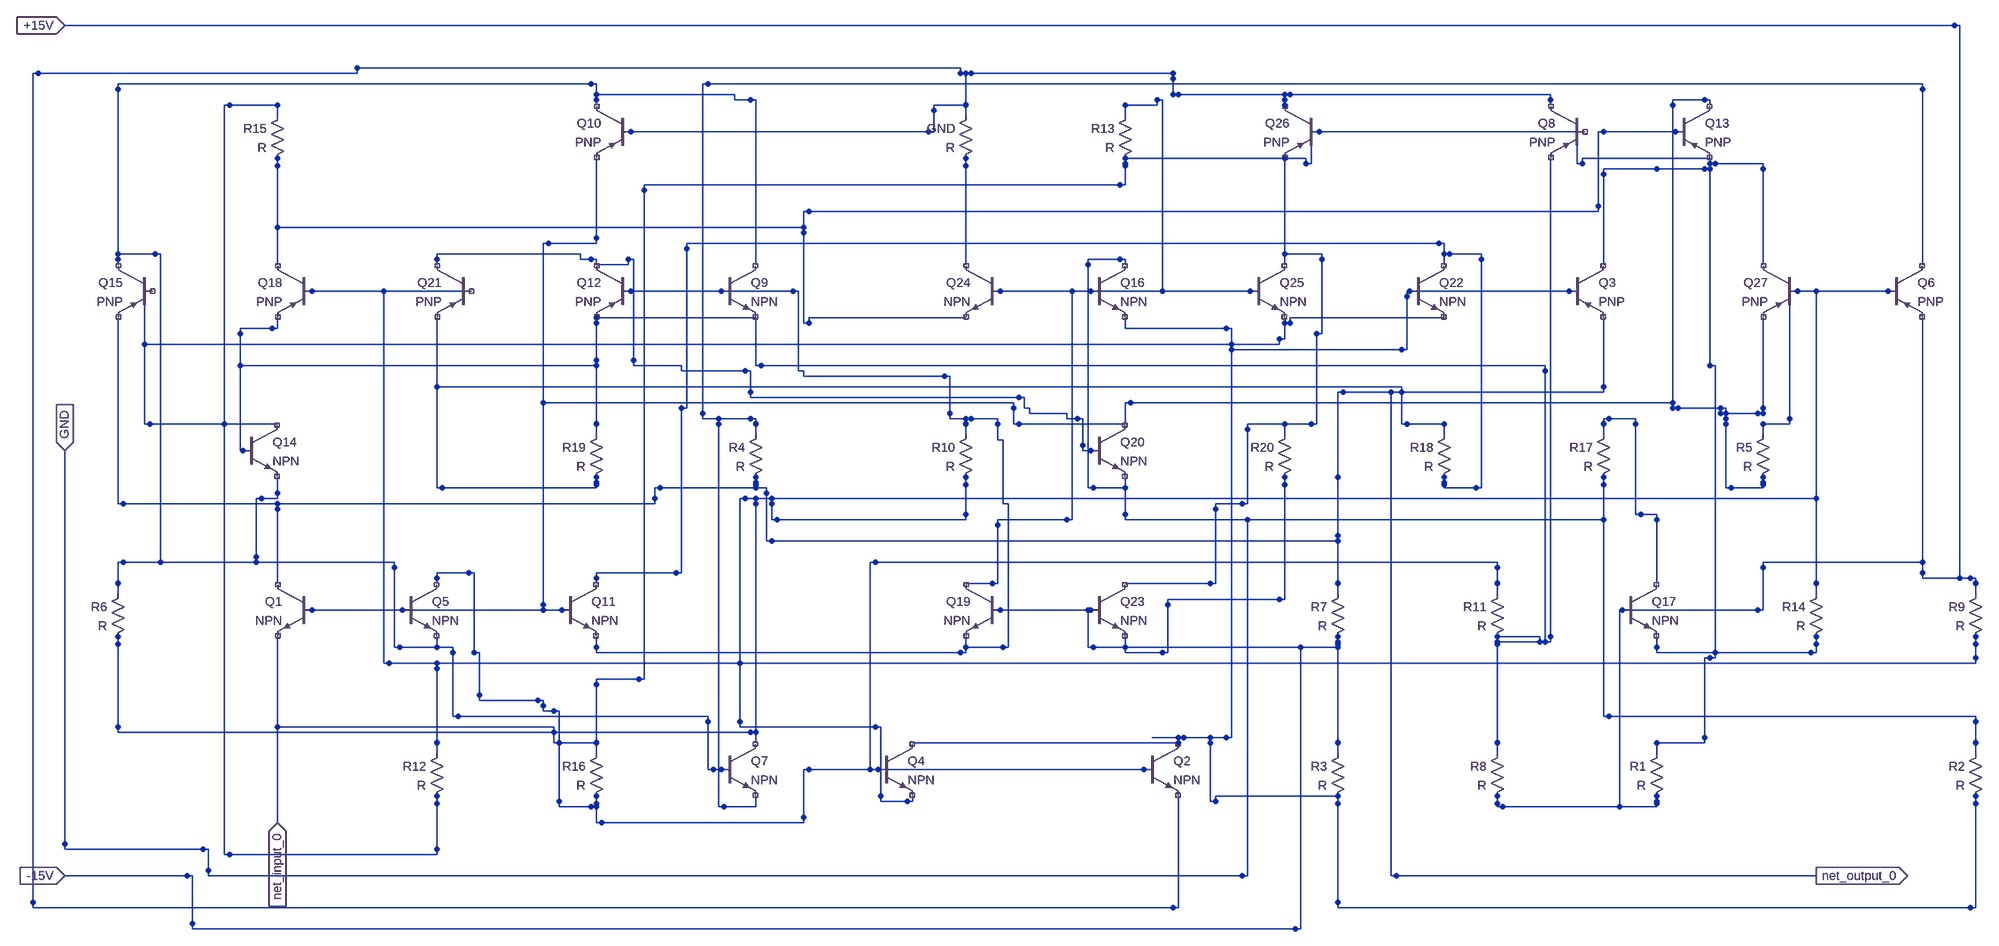
[diagram p0: schematic output-schematic.asc]
output-schematic.asc, the LTspice schematic file:
Version 4
SHEET 1 2000 4000
SYMBOL npn 715 1202 M0
SYMATTR InstName Q1
SYMBOL npn 2285 1502 R0
SYMATTR InstName Q2
SYMBOL pnp 3085 602 R0
SYMATTR InstName Q3
SYMBOL npn 1785 1502 R0
SYMATTR InstName Q4
SYMBOL npn 885 1202 R0
SYMATTR InstName Q5
SYMBOL pnp 3685 602 R0
SYMATTR InstName Q6
SYMBOL npn 1485 1502 R0
SYMATTR InstName Q7
SYMBOL pnp 3115 302 M0
SYMATTR InstName Q8
SYMBOL npn 1485 602 R0
SYMATTR InstName Q9
SYMBOL pnp 1315 302 M0
SYMATTR InstName Q10
SYMBOL npn 1185 1202 R0
SYMATTR InstName Q11
SYMBOL pnp 1315 602 M0
SYMATTR InstName Q12
SYMBOL pnp 3285 302 R0
SYMATTR InstName Q13
SYMBOL npn 585 902 R0
SYMATTR InstName Q14
SYMBOL pnp 415 602 M0
SYMATTR InstName Q15
SYMBOL npn 2185 602 R0
SYMATTR InstName Q16
SYMBOL npn 3185 1202 R0
SYMATTR InstName Q17
SYMBOL pnp 715 602 M0
SYMATTR InstName Q18
SYMBOL npn 2015 1202 M0
SYMATTR InstName Q19
SYMBOL npn 2185 902 R0
SYMATTR InstName Q20
SYMBOL pnp 1015 602 M0
SYMATTR InstName Q21
SYMBOL npn 2785 602 R0
SYMATTR InstName Q22
SYMBOL npn 2185 1202 R0
SYMATTR InstName Q23
SYMBOL npn 2015 602 M0
SYMATTR InstName Q24
SYMBOL npn 2485 602 R0
SYMATTR InstName Q25
SYMBOL pnp 2615 302 M0
SYMATTR InstName Q26
SYMBOL pnp 3515 602 M0
SYMATTR InstName Q27
SYMBOL res 3266 1504 M0
SYMATTR InstName R1
WIRE 3250 1520 3250 1499
WIRE 3250 1614 3250 1599
SYMBOL res 3866 1504 M0
SYMATTR InstName R2
WIRE 3850 1520 3850 1499
WIRE 3850 1614 3850 1599
SYMBOL res 2666 1504 M0
SYMATTR InstName R3
WIRE 2650 1520 2650 1499
WIRE 2650 1614 2650 1599
SYMBOL res 1566 904 M0
SYMATTR InstName R4
WIRE 1550 920 1550 899
WIRE 1550 1014 1550 999
SYMBOL res 3466 904 M0
SYMATTR InstName R5
WIRE 3450 920 3450 899
WIRE 3450 1014 3450 999
SYMBOL res 366 1204 M0
SYMATTR InstName R6
WIRE 350 1220 350 1199
WIRE 350 1314 350 1299
SYMBOL res 2666 1204 M0
SYMATTR InstName R7
WIRE 2650 1220 2650 1199
WIRE 2650 1314 2650 1299
SYMBOL res 2966 1504 M0
SYMATTR InstName R8
WIRE 2950 1520 2950 1499
WIRE 2950 1614 2950 1599
SYMBOL res 3866 1204 M0
SYMATTR InstName R9
WIRE 3850 1220 3850 1199
WIRE 3850 1314 3850 1299
SYMBOL res 1966 904 M0
SYMATTR InstName R10
WIRE 1950 920 1950 899
WIRE 1950 1014 1950 999
SYMBOL res 2966 1204 M0
SYMATTR InstName R11
WIRE 2950 1220 2950 1199
WIRE 2950 1314 2950 1299
SYMBOL res 966 1504 M0
SYMATTR InstName R12
WIRE 950 1520 950 1499
WIRE 950 1614 950 1599
SYMBOL res 2266 304 M0
SYMATTR InstName R13
WIRE 2250 320 2250 299
WIRE 2250 414 2250 399
SYMBOL res 3566 1204 M0
SYMATTR InstName R14
WIRE 3550 1220 3550 1199
WIRE 3550 1314 3550 1299
SYMBOL res 666 304 M0
SYMATTR InstName R15
WIRE 650 320 650 299
WIRE 650 414 650 399
SYMBOL res 1266 1504 M0
SYMATTR InstName R16
WIRE 1250 1520 1250 1499
WIRE 1250 1614 1250 1599
SYMBOL res 3166 904 M0
SYMATTR InstName R17
WIRE 3150 920 3150 899
WIRE 3150 1014 3150 999
SYMBOL res 2866 904 M0
SYMATTR InstName R18
WIRE 2850 920 2850 899
WIRE 2850 1014 2850 999
SYMBOL res 1266 904 M0
SYMATTR InstName R19
WIRE 1250 920 1250 899
WIRE 1250 1014 1250 999
SYMBOL res 2566 904 M0
SYMATTR InstName R20
WIRE 2550 920 2550 899
WIRE 2550 1014 2550 999
SYMBOL res 1966 304 M0
SYMATTR InstName R21
WIRE 1950 320 1950 299
WIRE 1950 414 1950 399
SYMATTR InstName net_output_0
FLAG 3550 1750 net_output_0
IOPIN 3550 1750 Out
SYMATTR InstName net_input_0
FLAG 650 1650 net_input_0
IOPIN 650 1650 In
SYMATTR InstName +15V
FLAG 250 150 +15V
IOPIN 250 150 In
SYMATTR InstName -15V
FLAG 250 1750 -15V
IOPIN 250 1750 In
SYMATTR InstName GND
FLAG 250 950 GND
IOPIN 250 950 In
WIRE 3700 650 3500 650
WIRE 3500 650 3500 890
WIRE 3500 890 3500 890
WIRE 3500 890 3500 900
WIRE 3500 900 3450 900
WIRE 3550 1200 3550 650
WIRE 350 1300 350 1470
WIRE 350 1470 350 1470
WIRE 350 1470 350 1480
WIRE 350 1480 1540 1480
WIRE 1540 1480 1540 1480
WIRE 1540 1480 1550 1480
WIRE 1550 1480 1550 1500
WIRE 1550 1500 1550 1050
WIRE 1550 1050 1550 1050
WIRE 1550 1050 1550 1040
WIRE 1550 1040 3550 1040
WIRE 700 650 1000 650
WIRE 1950 1000 1950 1070
WIRE 1950 1070 1950 1070
WIRE 1950 1070 1950 1080
WIRE 1950 1080 1590 1080
WIRE 1590 1080 1590 1080
WIRE 1590 1080 1580 1080
WIRE 1580 1080 1580 1050
WIRE 1580 1050 1580 1050
WIRE 1580 1050 1580 1040
WIRE 1580 1040 1530 1040
WIRE 1530 1040 1530 1040
WIRE 1530 1040 1520 1040
WIRE 1520 1040 1520 1460
WIRE 1520 1460 1520 1460
WIRE 1520 1460 1520 1470
WIRE 1520 1470 1780 1470
WIRE 1780 1470 1780 1470
WIRE 1780 1470 1790 1470
WIRE 1790 1470 1790 1600
WIRE 1790 1600 1790 1600
WIRE 1790 1600 1790 1610
WIRE 1790 1610 1840 1610
WIRE 1840 1610 1840 1610
WIRE 1840 1610 1850 1610
WIRE 1850 1610 1850 1600
WIRE 950 1500 950 1360
WIRE 950 1360 950 1360
WIRE 950 1360 950 1350
WIRE 950 1350 860 1350
WIRE 860 1350 860 1350
WIRE 860 1350 850 1350
WIRE 850 1350 850 650
WIRE 1520 1350 950 1350
WIRE 3850 1300 3850 1340
WIRE 3850 1340 3850 1340
WIRE 3850 1340 3850 1350
WIRE 3850 1350 1520 1350
WIRE 3450 600 3450 420
WIRE 3450 420 3450 420
WIRE 3450 420 3450 410
WIRE 3450 410 3360 410
WIRE 3360 410 3360 410
WIRE 3360 410 3350 410
WIRE 3350 410 3350 400
WIRE 3350 400 3110 400
WIRE 3110 400 3110 410
WIRE 3110 410 3110 410
WIRE 3110 410 3100 410
WIRE 3100 410 3100 350
WIRE 3150 600 3150 430
WIRE 3150 430 3150 430
WIRE 3150 430 3150 420
WIRE 3150 420 3340 420
WIRE 3340 420 3340 420
WIRE 3340 420 3350 420
WIRE 3350 420 3350 410
WIRE 650 1300 650 1650
WIRE 2250 400 2590 400
WIRE 2590 400 2590 410
WIRE 2590 410 2590 410
WIRE 2590 410 2600 410
WIRE 2600 410 2600 350
WIRE 3100 350 2600 350
WIRE 1250 1500 1180 1500
WIRE 1180 1500 1180 1500
WIRE 1180 1500 1170 1500
WIRE 1170 1500 1170 1480
WIRE 1170 1480 1170 1480
WIRE 1170 1480 1170 1470
WIRE 1170 1470 650 1470
WIRE 3250 420 3340 420
WIRE 3340 420 3340 420
WIRE 3340 420 3350 420
WIRE 3350 420 3350 790
WIRE 3350 790 3350 790
WIRE 3350 790 3360 790
WIRE 3360 790 3360 1330
WIRE 3360 1330 3360 1330
WIRE 3360 1330 3360 1340
WIRE 3360 1340 3350 1340
WIRE 3350 1340 3350 1340
WIRE 3350 1340 3340 1340
WIRE 3340 1340 3340 1490
WIRE 3340 1490 3340 1490
WIRE 3340 1490 3340 1500
WIRE 3340 1500 3250 1500
WIRE 1250 1500 1250 1390
WIRE 1250 1390 1250 1390
WIRE 1250 1390 1250 1380
WIRE 1250 1380 1330 1380
WIRE 1330 1380 1330 1380
WIRE 1330 1380 1340 1380
WIRE 1340 1380 1340 460
WIRE 1340 460 1340 460
WIRE 1340 460 1340 450
WIRE 1340 450 2240 450
WIRE 2240 450 2240 450
WIRE 2240 450 2250 450
WIRE 2250 450 2250 410
WIRE 700 1250 900 1250
WIRE 3450 1000 3450 1010
WIRE 3450 1010 3450 1020
WIRE 3450 1020 3390 1020
WIRE 3390 1020 3390 1020
WIRE 3390 1020 3380 1020
WIRE 3380 1020 3380 890
WIRE 3380 890 3380 890
WIRE 3380 890 3380 880
WIRE 3380 880 3440 880
WIRE 3440 880 3440 880
WIRE 3440 880 3450 880
WIRE 3450 880 3450 700
WIRE 1200 1250 900 1250
WIRE 3450 700 3450 870
WIRE 3450 870 3450 870
WIRE 3450 870 3450 880
WIRE 3450 880 3380 880
WIRE 3380 880 3380 880
WIRE 3380 880 3380 870
WIRE 3380 870 3290 870
WIRE 3290 870 3290 870
WIRE 3290 870 3280 870
WIRE 3280 870 3280 300
WIRE 3280 300 3280 300
WIRE 3280 300 3280 290
WIRE 3280 290 3340 290
WIRE 3340 290 3340 290
WIRE 3340 290 3350 290
WIRE 3350 290 3350 300
WIRE 1250 400 1250 550
WIRE 1250 550 1250 550
WIRE 1250 550 1250 560
WIRE 1250 560 1160 560
WIRE 1160 560 1160 560
WIRE 1160 560 1150 560
WIRE 1150 560 1150 1240
WIRE 1150 1240 1150 1240
WIRE 1150 1240 1150 1250
WIRE 1150 1250 1200 1250
WIRE 2250 900 2050 900
WIRE 2050 900 2050 900
WIRE 2050 900 2040 900
WIRE 2040 900 2040 870
WIRE 2040 870 2040 870
WIRE 2040 870 2040 860
WIRE 2040 860 1150 860
WIRE 3380 900 3380 880
WIRE 3380 880 3370 880
WIRE 3370 880 3370 880
WIRE 3370 880 3370 870
WIRE 3370 870 3280 870
WIRE 3280 870 3280 870
WIRE 3280 870 3280 860
WIRE 3280 860 2260 860
WIRE 2260 860 2260 860
WIRE 2260 860 2250 860
WIRE 2250 860 2250 900
WIRE 650 900 410 900
WIRE 410 900 410 900
WIRE 410 900 400 900
WIRE 400 900 400 650
WIRE 2850 700 2560 700
WIRE 2560 700 2560 710
WIRE 2560 710 2560 710
WIRE 2560 710 2550 710
WIRE 2550 710 2550 700
WIRE 650 300 560 300
WIRE 560 300 560 300
WIRE 560 300 550 300
WIRE 550 300 550 900
WIRE 950 1600 950 1700
WIRE 950 1700 950 1700
WIRE 950 1700 950 1710
WIRE 950 1710 560 1710
WIRE 560 1710 560 1710
WIRE 560 1710 550 1710
WIRE 550 1710 550 900
WIRE 2550 710 2550 740
WIRE 2550 740 2540 740
WIRE 2540 740 2540 740
WIRE 2540 740 2540 750
WIRE 2540 750 400 750
WIRE 2950 1500 2950 1300
WIRE 1250 900 1250 700
WIRE 600 950 590 950
WIRE 590 950 580 950
WIRE 580 950 580 730
WIRE 580 730 580 730
WIRE 580 730 580 720
WIRE 580 720 640 720
WIRE 640 720 640 720
WIRE 640 720 650 720
WIRE 650 720 650 700
WIRE 1550 700 1250 700
WIRE 1250 700 1250 710
WIRE 1250 700 1250 780
WIRE 1250 780 1250 780
WIRE 1250 780 1250 790
WIRE 1250 790 580 790
WIRE 3050 400 3050 1300
WIRE 3050 1300 3050 1300
WIRE 3050 1300 3050 1310
WIRE 3050 1310 2950 1310
WIRE 2950 1300 3030 1300
WIRE 3030 1300 3030 1310
WIRE 3030 1310 3030 1310
WIRE 3030 1310 3040 1310
WIRE 3040 1310 3040 800
WIRE 3040 800 3040 800
WIRE 3040 800 3040 790
WIRE 3040 790 1560 790
WIRE 1560 790 1560 790
WIRE 1560 790 1550 790
WIRE 1550 790 1550 700
WIRE 650 1200 650 1060
WIRE 650 1060 650 1060
WIRE 650 1060 650 1050
WIRE 650 1050 360 1050
WIRE 360 1050 360 1050
WIRE 360 1050 350 1050
WIRE 350 1050 350 700
WIRE 3150 700 3150 830
WIRE 3150 830 3150 830
WIRE 3150 830 3150 840
WIRE 3150 840 2660 840
WIRE 2660 840 2660 840
WIRE 2660 840 2650 840
WIRE 2650 840 2650 1200
WIRE 1550 1000 1550 1010
WIRE 1550 1010 1550 1020
WIRE 1550 1020 1370 1020
WIRE 1370 1020 1370 1020
WIRE 1370 1020 1360 1020
WIRE 1360 1020 1360 1040
WIRE 1360 1040 1360 1040
WIRE 1360 1040 1360 1050
WIRE 1360 1050 650 1050
WIRE 3550 1750 2760 1750
WIRE 2760 1750 2760 1750
WIRE 2760 1750 2750 1750
WIRE 2750 1750 2750 840
WIRE 2650 1000 2650 1110
WIRE 2650 1110 2650 1110
WIRE 2650 1110 2650 1120
WIRE 2650 1120 1580 1120
WIRE 1580 1120 1580 1120
WIRE 1580 1120 1570 1120
WIRE 1570 1120 1570 1030
WIRE 1570 1030 1570 1030
WIRE 1570 1030 1570 1020
WIRE 1570 1020 1550 1020
WIRE 1550 1600 1550 1610
WIRE 1550 1610 1550 1620
WIRE 1550 1620 1490 1620
WIRE 1490 1620 1490 1620
WIRE 1490 1620 1480 1620
WIRE 1480 1620 1480 900
WIRE 1480 900 1480 900
WIRE 1480 900 1480 890
WIRE 1480 890 1540 890
WIRE 1540 890 1540 890
WIRE 1540 890 1550 890
WIRE 1550 890 1550 900
WIRE 3750 600 3750 270
WIRE 3750 270 3750 270
WIRE 3750 270 3750 260
WIRE 3750 260 1460 260
WIRE 1460 260 1460 260
WIRE 1460 260 1450 260
WIRE 1450 260 1450 880
WIRE 1450 880 1450 880
WIRE 1450 880 1450 890
WIRE 1450 890 1480 890
WIRE 650 600 650 400
WIRE 1950 700 1650 700
WIRE 1650 700 1650 710
WIRE 1650 710 1650 710
WIRE 1650 710 1640 710
WIRE 1640 710 1640 540
WIRE 1640 540 1640 540
WIRE 1640 540 1640 530
WIRE 1640 530 650 530
WIRE 3300 350 3150 350
WIRE 3150 350 3150 350
WIRE 3150 350 3140 350
WIRE 3140 350 3140 490
WIRE 3140 490 3140 490
WIRE 3140 490 3140 500
WIRE 3140 500 1650 500
WIRE 1650 500 1650 500
WIRE 1650 500 1640 500
WIRE 1640 500 1640 530
WIRE 3050 300 3050 290
WIRE 3050 290 3050 290
WIRE 3050 290 3050 280
WIRE 3050 280 2560 280
WIRE 2560 280 2560 280
WIRE 2560 280 2550 280
WIRE 2550 280 2550 300
WIRE 2550 300 2550 290
WIRE 2550 290 2550 290
WIRE 2550 290 2550 280
WIRE 2550 280 2350 280
WIRE 2350 280 2350 280
WIRE 2350 280 2340 280
WIRE 2340 280 2340 250
WIRE 2340 250 2340 250
WIRE 2340 250 2340 240
WIRE 2340 240 1960 240
WIRE 1960 240 1960 240
WIRE 1960 240 1950 240
WIRE 1950 240 1950 300
WIRE 1300 350 1880 350
WIRE 1880 350 1880 350
WIRE 1880 350 1890 350
WIRE 1890 350 1890 310
WIRE 1890 310 1890 310
WIRE 1890 310 1890 300
WIRE 1890 300 1950 300
WIRE 2550 300 2550 290
WIRE 2550 290 2550 290
WIRE 2550 290 2550 280
WIRE 2550 280 2350 280
WIRE 2350 280 2350 280
WIRE 2350 280 2340 280
WIRE 2340 280 2340 250
WIRE 2340 250 2340 250
WIRE 2340 250 2340 240
WIRE 2340 240 1940 240
WIRE 1940 240 1940 240
WIRE 1940 240 1940 230
WIRE 1940 230 800 230
WIRE 800 230 800 230
WIRE 800 230 800 240
WIRE 800 240 200 240
WIRE 200 240 200 240
WIRE 200 240 190 240
WIRE 190 240 190 1800
WIRE 190 1800 190 1800
WIRE 190 1800 190 1810
WIRE 190 1810 2340 1810
WIRE 2340 1810 2340 1810
WIRE 2340 1810 2350 1810
WIRE 2350 1810 2350 1600
WIRE 3100 650 2800 650
WIRE 2650 1600 2420 1600
WIRE 2420 1600 2420 1610
WIRE 2420 1610 2420 1610
WIRE 2420 1610 2410 1610
WIRE 2410 1610 2410 1500
WIRE 2410 1500 2410 1500
WIRE 2410 1500 2410 1490
WIRE 2410 1490 2360 1490
WIRE 2360 1490 2360 1490
WIRE 2360 1490 2350 1490
WIRE 2350 1490 2350 1500
WIRE 1850 1500 2350 1500
WIRE 2350 1500 2350 1490
WIRE 2250 700 2250 710
WIRE 2250 710 2250 720
WIRE 2250 720 2440 720
WIRE 2440 720 2440 720
WIRE 2440 720 2450 720
WIRE 2450 720 2450 750
WIRE 2450 750 2450 750
WIRE 2450 750 2450 760
WIRE 2450 760 2770 760
WIRE 2770 760 2770 760
WIRE 2770 760 2780 760
WIRE 2780 760 2780 660
WIRE 2780 660 2780 660
WIRE 2780 660 2780 650
WIRE 2780 650 2800 650
WIRE 2300 1490 2440 1490
WIRE 2440 1490 2440 1490
WIRE 2440 1490 2450 1490
WIRE 2450 1490 2450 760
WIRE 2650 1600 2650 1800
WIRE 2650 1800 2650 1800
WIRE 2650 1800 2650 1810
WIRE 2650 1810 3840 1810
WIRE 3840 1810 3840 1810
WIRE 3840 1810 3850 1810
WIRE 3850 1810 3850 1600
WIRE 2250 1000 2250 1010
WIRE 2250 1010 2250 1020
WIRE 2250 1020 2190 1020
WIRE 2190 1020 2190 1020
WIRE 2190 1020 2180 1020
WIRE 2180 1020 2180 600
WIRE 2180 600 2180 600
WIRE 2180 600 2180 590
WIRE 2180 590 2240 590
WIRE 2240 590 2240 590
WIRE 2240 590 2250 590
WIRE 2250 590 2250 600
WIRE 3850 1500 3850 1460
WIRE 3850 1460 3850 1460
WIRE 3850 1460 3850 1450
WIRE 3850 1450 3160 1450
WIRE 3160 1450 3160 1450
WIRE 3160 1450 3150 1450
WIRE 3150 1450 3150 1000
WIRE 2250 1020 2250 1070
WIRE 2250 1070 2250 1070
WIRE 2250 1070 2250 1080
WIRE 2250 1080 3150 1080
WIRE 250 950 250 1690
WIRE 250 1690 250 1690
WIRE 250 1690 250 1700
WIRE 250 1700 510 1700
WIRE 510 1700 510 1700
WIRE 510 1700 520 1700
WIRE 520 1700 520 1740
WIRE 520 1740 520 1740
WIRE 520 1740 520 1750
WIRE 520 1750 2470 1750
WIRE 2470 1750 2470 1750
WIRE 2470 1750 2480 1750
WIRE 2480 1750 2480 1080
WIRE 650 1000 650 1030
WIRE 650 1030 650 1030
WIRE 650 1030 650 1040
WIRE 650 1040 620 1040
WIRE 620 1040 620 1040
WIRE 620 1040 610 1040
WIRE 610 1040 610 1150
WIRE 610 1150 610 1150
WIRE 610 1150 610 1160
WIRE 610 1160 360 1160
WIRE 360 1160 360 1160
WIRE 360 1160 350 1160
WIRE 350 1160 350 1200
WIRE 1250 300 1250 290
WIRE 1250 290 1250 290
WIRE 1250 290 1250 280
WIRE 1250 280 1500 280
WIRE 1500 280 1510 280
WIRE 1510 280 1510 290
WIRE 1510 290 1540 290
WIRE 1540 290 1540 290
WIRE 1540 290 1550 290
WIRE 1550 290 1550 600
WIRE 950 1300 950 1310
WIRE 950 1310 950 1320
WIRE 950 1320 880 1320
WIRE 880 1320 880 1320
WIRE 880 1320 870 1320
WIRE 870 1320 870 1170
WIRE 870 1170 870 1170
WIRE 870 1170 870 1160
WIRE 870 1160 610 1160
WIRE 1500 1550 1470 1550
WIRE 1470 1550 1470 1550
WIRE 1470 1550 1460 1550
WIRE 1460 1550 1460 1460
WIRE 1460 1460 1460 1460
WIRE 1460 1460 1460 1450
WIRE 1460 1450 990 1450
WIRE 990 1450 990 1450
WIRE 990 1450 980 1450
WIRE 980 1450 980 1330
WIRE 980 1330 980 1330
WIRE 980 1330 980 1320
WIRE 980 1320 950 1320
WIRE 350 600 350 590
WIRE 350 590 350 590
WIRE 350 590 350 580
WIRE 350 580 420 580
WIRE 420 580 420 580
WIRE 420 580 430 580
WIRE 430 580 430 1160
WIRE 350 600 350 270
WIRE 350 270 350 270
WIRE 350 270 350 260
WIRE 350 260 1240 260
WIRE 1240 260 1240 260
WIRE 1240 260 1250 260
WIRE 1250 260 1250 280
WIRE 950 1200 950 1190
WIRE 950 1190 950 1190
WIRE 950 1190 950 1180
WIRE 950 1180 1010 1180
WIRE 1010 1180 1010 1180
WIRE 1010 1180 1020 1180
WIRE 1020 1180 1020 1330
WIRE 1020 1330 1020 1330
WIRE 1020 1330 1030 1330
WIRE 1030 1330 1030 1410
WIRE 1030 1410 1030 1410
WIRE 1030 1410 1030 1420
WIRE 1030 1420 1140 1420
WIRE 1140 1420 1140 1420
WIRE 1140 1420 1150 1420
WIRE 1150 1420 1150 1430
WIRE 1150 1430 1150 1430
WIRE 1150 1430 1150 1440
WIRE 1150 1440 1170 1440
WIRE 1170 1440 1170 1440
WIRE 1170 1440 1180 1440
WIRE 1180 1440 1180 1610
WIRE 1180 1610 1180 1610
WIRE 1180 1610 1180 1620
WIRE 1180 1620 1240 1620
WIRE 1240 1620 1240 1620
WIRE 1240 1620 1250 1620
WIRE 1250 1620 1250 1600
WIRE 1800 1550 2300 1550
WIRE 1800 1550 1650 1550
WIRE 1650 1550 1650 1550
WIRE 1650 1550 1640 1550
WIRE 1640 1550 1640 1640
WIRE 1640 1640 1640 1640
WIRE 1640 1640 1640 1650
WIRE 1640 1650 1260 1650
WIRE 1260 1650 1260 1650
WIRE 1260 1650 1250 1650
WIRE 1250 1650 1250 1620
WIRE 2950 1200 2950 1170
WIRE 2950 1170 2950 1170
WIRE 2950 1170 2950 1160
WIRE 2950 1160 1780 1160
WIRE 1780 1160 1780 1160
WIRE 1780 1160 1770 1160
WIRE 1770 1160 1770 1550
WIRE 1250 1000 1250 1010
WIRE 1250 1010 1250 1020
WIRE 1250 1020 960 1020
WIRE 960 1020 960 1020
WIRE 960 1020 950 1020
WIRE 950 1020 950 700
WIRE 2850 900 2780 900
WIRE 2780 900 2780 900
WIRE 2780 900 2770 900
WIRE 2770 900 2770 840
WIRE 2770 840 2770 840
WIRE 2770 840 2770 830
WIRE 2770 830 950 830
WIRE 2850 1000 2850 1010
WIRE 2850 1010 2850 1020
WIRE 2850 1020 2910 1020
WIRE 2910 1020 2910 1020
WIRE 2910 1020 2920 1020
WIRE 2920 1020 2920 590
WIRE 2920 590 2920 590
WIRE 2920 590 2920 580
WIRE 2920 580 2860 580
WIRE 2860 580 2860 580
WIRE 2860 580 2850 580
WIRE 2850 580 2850 600
WIRE 1250 1200 1250 1190
WIRE 1250 1190 1250 1190
WIRE 1250 1190 1250 1180
WIRE 1250 1180 1400 1180
WIRE 1400 1180 1400 1180
WIRE 1400 1180 1410 1180
WIRE 1410 1180 1410 870
WIRE 1410 870 1410 870
WIRE 1410 870 1420 870
WIRE 1420 870 1420 570
WIRE 1420 570 1420 570
WIRE 1420 570 1420 560
WIRE 1420 560 2840 560
WIRE 2840 560 2840 560
WIRE 2840 560 2850 560
WIRE 2850 560 2850 580
WIRE 3250 1600 3250 1610
WIRE 3250 1610 3250 1620
WIRE 3250 1620 2960 1620
WIRE 2960 1620 2960 1620
WIRE 2960 1620 2950 1620
WIRE 2950 1620 2950 1600
WIRE 3200 1250 3190 1250
WIRE 3190 1250 3180 1250
WIRE 3180 1250 3180 1620
WIRE 3750 700 3750 1180
WIRE 3750 1180 3750 1180
WIRE 3750 1180 3750 1190
WIRE 3750 1190 3840 1190
WIRE 3840 1190 3840 1190
WIRE 3840 1190 3850 1190
WIRE 3850 1190 3850 1200
WIRE 3200 1250 3440 1250
WIRE 3440 1250 3440 1250
WIRE 3440 1250 3450 1250
WIRE 3450 1250 3450 1170
WIRE 3450 1170 3450 1170
WIRE 3450 1170 3450 1160
WIRE 3450 1160 3750 1160
WIRE 250 150 3810 150
WIRE 3810 150 3810 150
WIRE 3810 150 3820 150
WIRE 3820 150 3820 1190
WIRE 950 600 950 590
WIRE 950 590 950 590
WIRE 950 590 950 580
WIRE 950 580 1210 580
WIRE 1210 580 1220 580
WIRE 1220 580 1220 590
WIRE 1220 590 1240 590
WIRE 1240 590 1240 590
WIRE 1240 590 1250 590
WIRE 1250 590 1250 600
WIRE 1250 600 1310 600
WIRE 1310 600 1310 590
WIRE 1310 590 1310 590
WIRE 1310 590 1320 590
WIRE 1320 590 1320 780
WIRE 1320 780 1320 780
WIRE 1320 780 1320 790
WIRE 1320 790 1400 790
WIRE 1400 790 1410 790
WIRE 1410 790 1410 800
WIRE 1410 800 1530 800
WIRE 1530 800 1530 800
WIRE 1530 800 1540 800
WIRE 1540 800 1540 840
WIRE 1540 840 1540 840
WIRE 1540 840 1540 850
WIRE 1540 850 2050 850
WIRE 2050 850 2050 850
WIRE 2050 850 2060 850
WIRE 2060 850 2060 870
WIRE 2060 870 2070 870
WIRE 2070 870 2070 880
WIRE 2070 880 2130 880
WIRE 2130 880 2140 880
WIRE 2140 880 2140 890
WIRE 2140 890 2160 890
WIRE 2160 890 2160 890
WIRE 2160 890 2170 890
WIRE 2170 890 2170 940
WIRE 2170 940 2170 940
WIRE 2170 940 2170 950
WIRE 2170 950 2200 950
WIRE 2000 650 2200 650
WIRE 2500 650 2200 650
WIRE 2250 300 2310 300
WIRE 2310 300 2310 290
WIRE 2310 290 2310 290
WIRE 2310 290 2320 290
WIRE 2320 290 2320 650
WIRE 1950 1200 2000 1200
WIRE 2000 1200 2000 1200
WIRE 2000 1200 2010 1200
WIRE 2010 1200 2010 1090
WIRE 2010 1090 2010 1090
WIRE 2010 1090 2010 1080
WIRE 2010 1080 2140 1080
WIRE 2140 1080 2140 1080
WIRE 2140 1080 2150 1080
WIRE 2150 1080 2150 650
WIRE 1500 650 1300 650
WIRE 1950 1300 1950 1310
WIRE 1950 1310 1950 1320
WIRE 1950 1320 2020 1320
WIRE 2020 1320 2020 1320
WIRE 2020 1320 2030 1320
WIRE 2030 1320 2030 1060
WIRE 2030 1060 2030 1050
WIRE 2030 1050 2020 1050
WIRE 2020 1050 2020 940
WIRE 2020 940 2020 930
WIRE 2020 930 2010 930
WIRE 2010 930 2010 900
WIRE 2010 900 2010 900
WIRE 2010 900 2010 890
WIRE 2010 890 1960 890
WIRE 1960 890 1960 890
WIRE 1960 890 1950 890
WIRE 1950 890 1950 900
WIRE 1500 650 1620 650
WIRE 1620 650 1620 650
WIRE 1620 650 1630 650
WIRE 1630 650 1630 800
WIRE 1630 800 1640 800
WIRE 1640 800 1640 810
WIRE 1640 810 1910 810
WIRE 1910 810 1910 810
WIRE 1910 810 1920 810
WIRE 1920 810 1920 880
WIRE 1920 880 1920 880
WIRE 1920 880 1920 890
WIRE 1920 890 1950 890
WIRE 1250 1300 1250 1320
WIRE 1250 1320 1250 1320
WIRE 1250 1320 1250 1330
WIRE 1250 1330 1940 1330
WIRE 1940 1330 1940 1330
WIRE 1940 1330 1950 1330
WIRE 1950 1330 1950 1320
WIRE 2550 600 2550 400
WIRE 2550 900 2600 900
WIRE 2600 900 2600 900
WIRE 2600 900 2610 900
WIRE 2610 900 2610 730
WIRE 2610 730 2610 730
WIRE 2610 730 2620 730
WIRE 2620 730 2620 590
WIRE 2620 590 2620 590
WIRE 2620 590 2620 580
WIRE 2620 580 2550 580
WIRE 2250 1200 2410 1200
WIRE 2410 1200 2410 1200
WIRE 2410 1200 2420 1200
WIRE 2420 1200 2420 1060
WIRE 2420 1060 2420 1060
WIRE 2420 1060 2420 1050
WIRE 2420 1050 2470 1050
WIRE 2470 1050 2470 1050
WIRE 2470 1050 2480 1050
WIRE 2480 1050 2480 910
WIRE 2480 910 2480 910
WIRE 2480 910 2480 900
WIRE 2480 900 2550 900
WIRE 2650 1500 2650 1300
WIRE 2000 1250 2200 1250
WIRE 2650 1300 2650 1310
WIRE 2650 1310 2650 1320
WIRE 2650 1320 2190 1320
WIRE 2190 1320 2190 1320
WIRE 2190 1320 2180 1320
WIRE 2180 1320 2180 1250
WIRE 250 1750 480 1750
WIRE 480 1750 480 1750
WIRE 480 1750 490 1750
WIRE 490 1750 490 1840
WIRE 490 1840 490 1840
WIRE 490 1840 490 1850
WIRE 490 1850 2570 1850
WIRE 2570 1850 2570 1850
WIRE 2570 1850 2580 1850
WIRE 2580 1850 2580 1320
WIRE 2250 1300 2250 1320
WIRE 2250 1320 2250 1320
WIRE 2250 1320 2250 1330
WIRE 2250 1330 2320 1330
WIRE 2320 1330 2320 1330
WIRE 2320 1330 2330 1330
WIRE 2330 1330 2330 1240
WIRE 2330 1240 2330 1240
WIRE 2330 1240 2330 1230
WIRE 2330 1230 2540 1230
WIRE 2540 1230 2540 1230
WIRE 2540 1230 2550 1230
WIRE 2550 1230 2550 1000
WIRE 3250 1200 3250 1080
WIRE 3250 1080 3250 1080
WIRE 3250 1080 3250 1070
WIRE 3250 1070 3220 1070
WIRE 3220 1070 3220 1070
WIRE 3220 1070 3210 1070
WIRE 3210 1070 3210 900
WIRE 3210 900 3210 900
WIRE 3210 900 3210 890
WIRE 3210 890 3160 890
WIRE 3160 890 3160 890
WIRE 3160 890 3150 890
WIRE 3150 890 3150 900
WIRE 1950 600 1950 400
WIRE 3250 1300 3250 1320
WIRE 3250 1320 3250 1320
WIRE 3250 1320 3250 1330
WIRE 3250 1330 3540 1330
WIRE 3540 1330 3540 1330
WIRE 3540 1330 3550 1330
WIRE 3550 1330 3550 1300

The netlist it stands for:
* output-schematic.asc
* Q1: NPN (symbol npn not certain, pin order unknown); nets seen at it: 0, N003
* Q2: NPN (symbol npn not certain, pin order unknown); nets seen at it: 0, net_input_0
* Q3: PNP (symbol pnp not certain, pin order unknown); nets seen at it: 0, N001
* Q4: NPN (symbol npn not certain, pin order unknown); nets seen at it: 0, net_input_0
* Q5: NPN (symbol npn not certain, pin order unknown); nets seen at it: 0, N003
* Q6: PNP (symbol pnp not certain, pin order unknown); nets seen at it: 0, net_input_0
* Q7: NPN (symbol npn not certain, pin order unknown); nets seen at it: 0, N004
* Q8: PNP (symbol pnp not certain, pin order unknown); nets seen at it: 0
* Q9: NPN (symbol npn not certain, pin order unknown); nets seen at it: 0, N006
* Q10: PNP (symbol pnp not certain, pin order unknown); nets seen at it: 0, N011
* Q11: NPN (symbol npn not certain, pin order unknown); nets seen at it: 0, N003
* Q12: PNP (symbol pnp not certain, pin order unknown); nets seen at it: 0, N006
* Q13: PNP (symbol pnp not certain, pin order unknown); nets seen at it: 0, N008
* Q14: NPN (symbol npn not certain, pin order unknown); nets seen at it: 0, N005
* Q15: PNP (symbol pnp not certain, pin order unknown); nets seen at it: 0
* Q16: NPN (symbol npn not certain, pin order unknown); nets seen at it: 0, N007
* Q17: NPN (symbol npn not certain, pin order unknown); nets seen at it: +15V, 0
* Q18: PNP (symbol pnp not certain, pin order unknown); nets seen at it: 0, net_input_0
* Q19: NPN (symbol npn not certain, pin order unknown); nets seen at it: -15V, 0
* Q20: NPN (symbol npn not certain, pin order unknown); nets seen at it: 0, N013
* Q21: PNP (symbol pnp not certain, pin order unknown); nets seen at it: 0
* Q22: NPN (symbol npn not certain, pin order unknown); nets seen at it: 0, N001
* Q23: NPN (symbol npn not certain, pin order unknown); nets seen at it: -15V, 0
* Q24: NPN (symbol npn not certain, pin order unknown); nets seen at it: 0, N007
* Q25: NPN (symbol npn not certain, pin order unknown); nets seen at it: 0, N007
Q26 NC_54 net_input_0 NC_55 0 PNP
* Q27: PNP (symbol pnp not certain, pin order unknown); nets seen at it: 0, net_input_0
R1 net_input_0 +15V R
R2 GND N001 R
R3 -15V N001 R
R4 N002 net_output_0 R
R5 net_input_0 N003 R
R6 N004 net_input_0 R
R7 net_output_0 -15V R
R8 N005 +15V R
R9 +15V net_input_0 R
R10 N006 net_input_0 R
R11 net_input_0 N005 R
R12 net_input_0 N001 R
R13 N007 net_input_0 R
R14 net_input_0 net_input_0 R
R15 N001 N008 R
R16 net_input_0 net_input_0 R
R17 N009 GND R
R18 net_output_0 N010 R
R19 N005 net_output_0 R
R20 net_input_0 -15V R
R§GND N011 N012 R
.model NPN NPN
.model PNP PNP
.lib standard.bjt
.backanno
.end